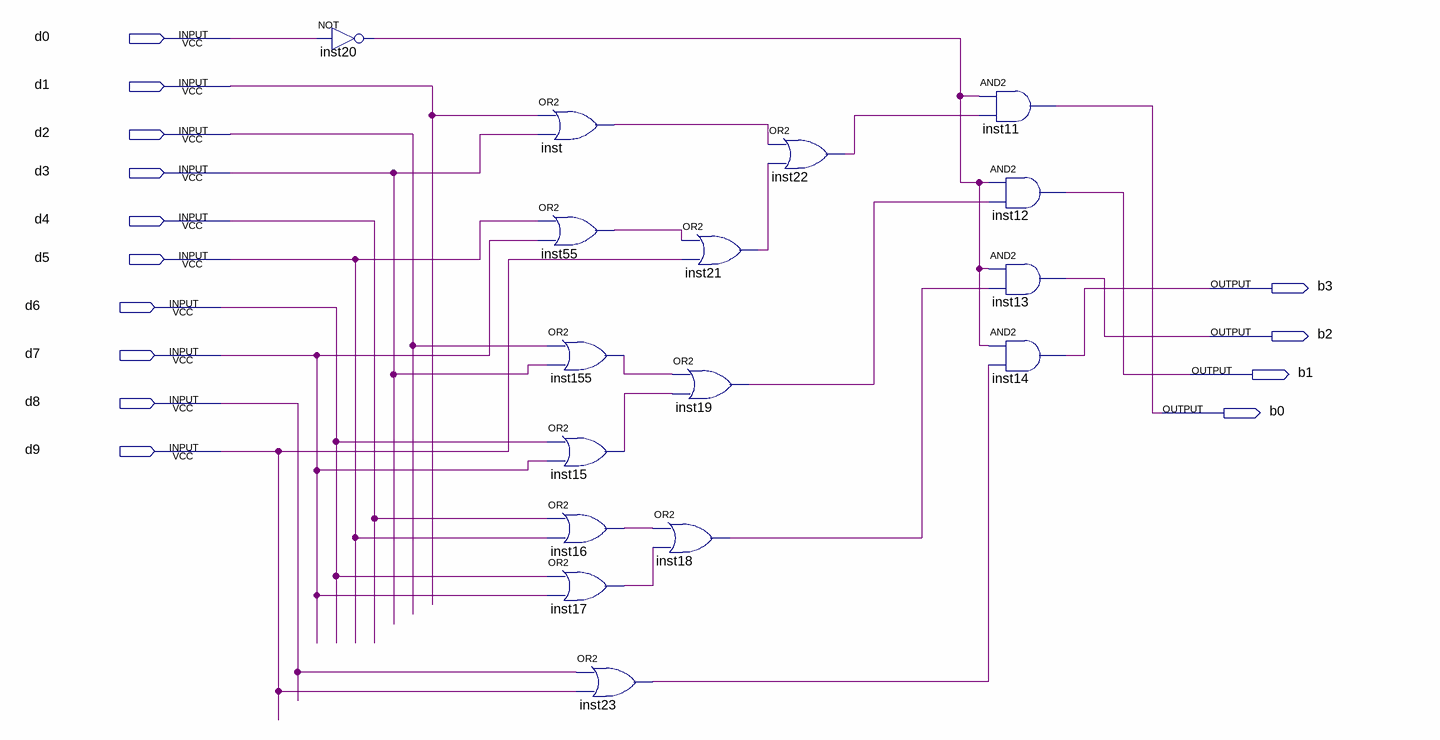
[diagram p0: schematic sheet]
// Quartus schematic d2b.bdf as structural Verilog: 16 symbols, 14 pins
module d2b (
  input  d0,
  input  d1,
  input  d2,
  input  d3,
  input  d4,
  input  d5,
  input  d6,
  input  d7,
  input  d8,
  input  d9,
  output b3,
  output b2,
  output b1,
  output b0
);

  wire inst15_out, inst16_out, inst17_out, inst18_out, inst19_out, inst20_out, inst21_out, inst22_out,
       inst23_out, inst55_out, inst155_out, inst_out;

  not inst20 (inst20_out, d0);
  or inst (inst_out, d1, d3);
  or inst55 (inst55_out, d5, d7);
  or inst155 (inst155_out, d2, d3);
  or inst15 (inst15_out, d6, d7);
  or inst16 (inst16_out, d4, d5);
  or inst17 (inst17_out, d6, d7);
  or inst23 (inst23_out, d8, d9);
  or inst18 (inst18_out, inst16_out, inst17_out);
  or inst21 (inst21_out, inst55_out, d9);
  or inst19 (inst19_out, inst155_out, inst15_out);
  or inst22 (inst22_out, inst_out, inst21_out);
  and inst11 (b0, inst20_out, inst22_out);
  and inst12 (b1, inst20_out, inst19_out);
  and inst13 (b2, inst20_out, inst18_out);
  and inst14 (b3, inst20_out, inst23_out);
endmodule
